# EAGLE design futurew (EAGLE 9.4.1)
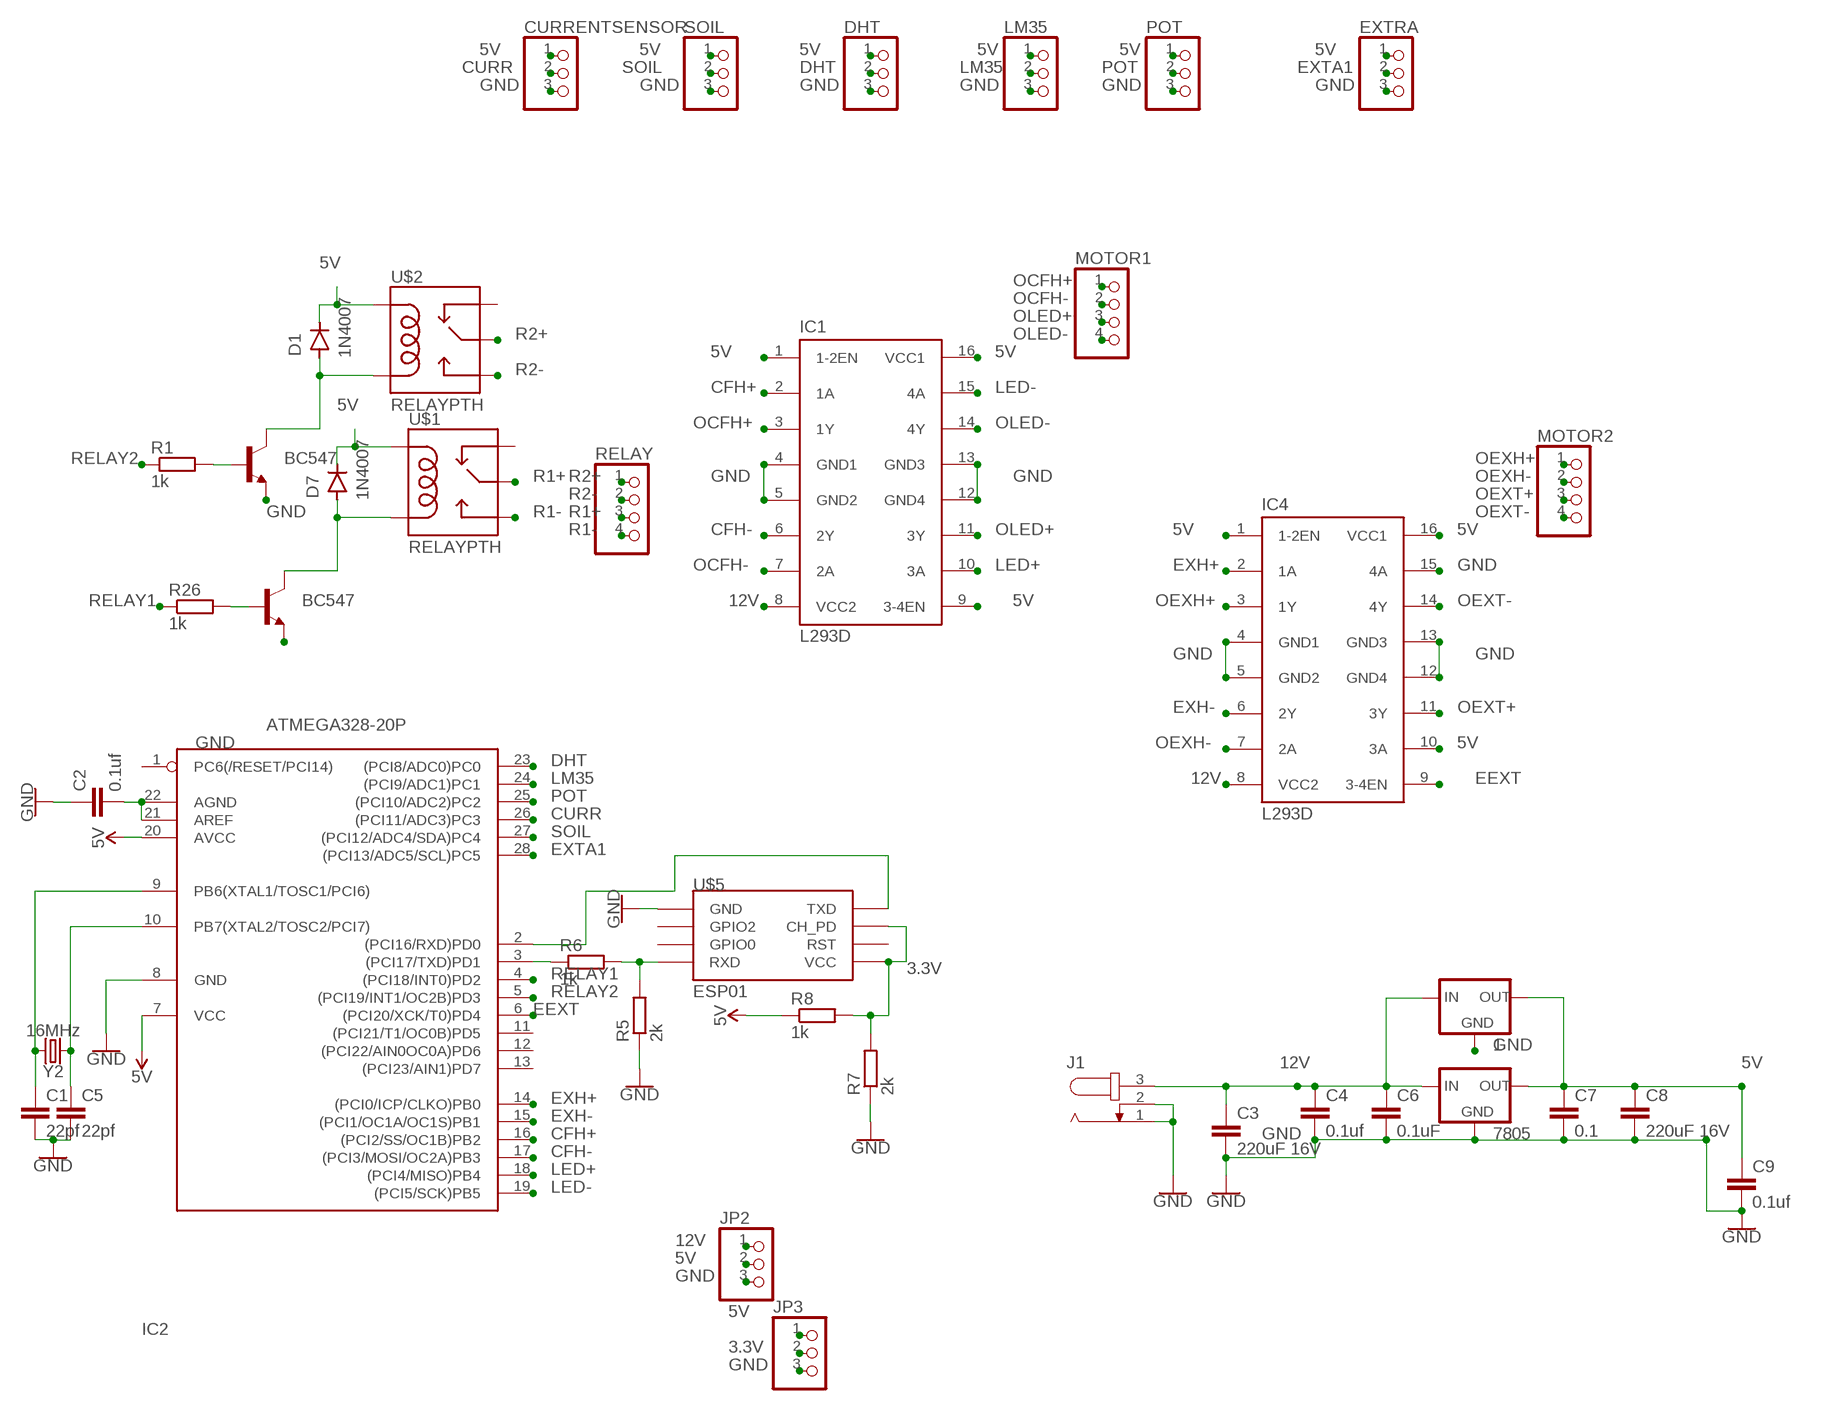
[diagram p0: schematic, sheet 1]

## Parts
1  78XXL  [78XXL]
7805  78XXL  [78XXL]
C1  22pf  C2,5-3  [C2.5-3]
C2  0.1uf  C2,5-3  [C2.5-3]
C3  220uF 16V  C2,5-3  [C2.5-3]
C4  0.1uf  C2,5-3  [C2.5-3]
C5  22pf  C2,5-3  [C2.5-3]
C6  0.1uF  C2,5-3  [C2.5-3]
C7  0.1  C2,5-3  [C2.5-3]
C8  220uF 16V  C2,5-3  [C2.5-3]
C9  0.1uf  C2,5-3  [C2.5-3]
CURRENTSENSOR  PINHD-1X3  [1X03]
D1  1N4007  [DO-41]
D7  1N4007  [DO-41]
DHT  PINHD-1X3  [1X03]
EXTRA  PINHD-1X3  [1X03]
IC1  L293D  [DIL16]
IC2  ATMEGA328-20P  [DIL28-3]
IC4  L293D  [DIL16]
J1  JACK-PLUG1  [SPC4078]
JP2  PINHD-1X3  [1X03]
JP3  PINHD-1X3  [1X03]
LM35  PINHD-1X3  [1X03]
MOTOR1  PINHD-1X4  [1X04]
MOTOR2  PINHD-1X4  [1X04]
POT  PINHD-1X3  [1X03]
R1  1k  R-EU_0204/5  [0204/5]
R5  2k  R-EU_0204/5  [0204/5]
R6  1k  R-EU_0204/5  [0204/5]
R7  2k  R-EU_0204/5  [0204/5]
R8  1k  R-EU_0204/5  [0204/5]
R26  1k  R-EU_0204/5  [0204/5]
RELAY  PINHD-1X4  [1X04]
SOIL  PINHD-1X3  [1X03]
T1  BC547  [TO92]
T3  BC547  [TO92]
U$1  RELAYPTH  [SRD-05VDC-SL-C]
U$2  RELAYPTH  [SRD-05VDC-SL-C]
U$5  ESP01  [ESP01]
Y2  16MHz  CRYSTAL-16MHZPTH-HC49US  [HC49US]

## Nets
3.3V: JP3.2 R7.2 R8.2 U$5.CH_PD U$5.VCC
5V: 1.OUT 7805.OUT C7.1 C8.1 C9.1 CURRENTSENSOR.1 D1.C D7.C DHT.1 EXTRA.1 IC1.1(1-2EN) IC1.9(3-4EN) IC1.16(VCC1) IC2.7(VCC) IC2.20(AVCC) IC4.1(1-2EN) IC4.10(3A) IC4.16(VCC1) JP2.2 JP3.1 LM35.1 POT.1 R8.1 SOIL.1 U$1.COIL1 U$2.COIL1
12V: 1.IN 7805.IN C3.1 C4.1 C6.1 IC1.8(VCC2) IC4.8(VCC2) J1.3 JP2.1
CFH+: IC1.2(1A) IC2.16((PCI2/SS/OC1B)PB2)
CFH-: IC1.6(2Y) IC2.17((PCI3/MOSI/OC2A)PB3)
CURR: CURRENTSENSOR.2 IC2.26((PCI11/ADC3)PC3)
DHT: DHT.2 IC2.23((PCI8/ADC0)PC0)
EEXT: IC2.6((PCI20/XCK/T0)PD4) IC4.9(3-4EN)
EXH+: IC2.14((PCI0/ICP/CLKO)PB0) IC4.2(1A)
EXH-: IC2.15((PCI1/OC1A/OC1S)PB1) IC4.6(2Y)
EXTA1: EXTRA.2 IC2.28((PCI13/ADC5/SCL)PC5)
GND: 1.GND 7805.GND C1.2 C2.1 C3.2 C4.2 C5.2 C6.2 C7.2 C8.2 C9.2 CURRENTSENSOR.3 DHT.3 EXTRA.3 IC1.4(GND1) IC1.5(GND2) IC1.12(GND4) IC1.13(GND3) IC2.8(GND) IC4.4(GND1) IC4.5(GND2) IC4.12(GND4) IC4.13(GND3) IC4.15(4A) J1.1 J1.2 JP2.3 JP3.3 LM35.3 POT.3 R5.1 R7.1 SOIL.3 T1.1(E) T3.1(E) U$5.GND
LED+: IC1.10(3A) IC2.18((PCI4/MISO)PB4)
LED-: IC1.15(4A) IC2.19((PCI5/SCK)PB5)
LM35: IC2.24((PCI9/ADC1)PC1) LM35.2
N$1: R5.2 R6.2 U$5.RX(RXD)
N$2: IC2.3((PCI17/TXD)PD1) R6.1
N$3: IC2.2((PCI16/RXD)PD0) U$5.TX(TXD)
N$4: D7.A T3.3(C) U$1.COIL0
N$5: R1.2 T1.2(B)
N$6: D1.A T1.3(C) U$2.COIL0
N$11: C2.2 IC2.21(AREF) IC2.22(AGND)
N$28: R26.2 T3.2(B)
N$43: C5.1 IC2.10(PB7(XTAL2/TOSC2/PCI7)) Y2.1
N$45: C1.1 IC2.9(PB6(XTAL1/TOSC1/PCI6)) Y2.2
OCFH+: IC1.3(1Y) MOTOR1.1
OCFH-: IC1.7(2A) MOTOR1.2
OEXH+: IC4.3(1Y) MOTOR2.1
OEXH-: IC4.7(2A) MOTOR2.2
OEXT+: IC4.11(3Y) MOTOR2.3
OEXT-: IC4.14(4Y) MOTOR2.4
OLED+: IC1.11(3Y) MOTOR1.3
OLED-: IC1.14(4Y) MOTOR1.4
POT: IC2.25((PCI10/ADC2)PC2) POT.2
R1+: RELAY.3 U$1.SWCOMMON
R1-: RELAY.4 U$1.SWOPEN
R2+: RELAY.1 U$2.SWCOMMON
R2-: RELAY.2 U$2.SWOPEN
RELAY1: IC2.4((PCI18/INT0)PD2) R26.1
RELAY2: IC2.5((PCI19/INT1/OC2B)PD3) R1.1
SOIL: IC2.27((PCI12/ADC4/SDA)PC4) SOIL.2
Unconnected: IC2.1(PC6(/RESET/PCI14)) IC2.11((PCI21/T1/OC0B)PD5) IC2.12((PCI22/AIN0OC0A)PD6) IC2.13((PCI23/AIN1)PD7) U$1.SWCLOSED(SWCLOSE) U$2.SWCLOSED(SWCLOSE) U$5.GPIO0 U$5.GPIO2 U$5.RST

## Library data of the parts
1 7805 = v-reg:78XXL: VOLTAGE REGULATOR
C1-C9 = capacitor-wima:C: CAPACITOR naming: grid - package width
CURRENTSENSOR DHT EXTRA JP2 JP3 LM35 POT SOIL = pinhead:PINHD-1X3: PIN HEADER
D1 D7 = Diodes:1N4007: DIODE GEN PURP 1KV 1A DO41; CREATED_BY: PCB Layout; DIGIKEY_PART_NUMBER: 1N4007MSCT-ND; MANUFACTURER: Micro Commercial Co; MPN: 1N4007; PACKAGE: DO-41
IC1 IC4 = st-microelectronics:L293D: PUSH-PULL 4 CHANNEL DRIVER; MPN: L293D; OC_FARNELL: 9589619; OC_NEWARK: 56P8249
IC2 = atmega328:ATMEGA328*P: MICROCONTROLLER 32 kBytes FLASH 2 kBytes SRAM 1 kBytes EEPROM USART 8-channel 10 bit ADC
J1 = con-jack:JACK-PLUG: DC POWER JACK Power Jack, DC, Right Angle, Through Hole, Rated 5A at 16VDC, PC Terminals Distributor: Farnell (www.Farnell.de) Drawing: 84N1161.pdf / 84N1162.pdf Manufacturer: SPC Technology (www.spctechnology.com) Type: SPC4077 / SPC 4078; OC_FARNELL: unknown; OC_NEWARK: unknown
MOTOR1 MOTOR2 RELAY = pinhead:PINHD-1X4: PIN HEADER
R1 R5-R8 R26 = resistor:R-EU_: RESISTOR, European symbol
T1 T3 = transistor:BC547: NPN TRANSISTOR
U$1 U$2 = SRD-05VDC-SL-C:RELAY: SPDT relay (COM-00101)
U$5 = esp8266modules:ESP01: ESP8266 Wifi module 01
Y2 = SparkFun-Clocks:CRYSTAL-16MHZ: 16MHz Crystal Digikey Example <http://www.digikey.com/product-search/en?keywords=535-9122-1-ND> Frequency: 16MHz Frequency Stability: ±50ppm Frequency Tolerance: ±20ppm Load Capacitance: 18pF SparkFun Products: Pro Micro -5V/16MHz <https://www.sparkfun.com/products/12640> SparkFun Serial Enabled LCD Kit <https://www.sparkfun.com/products/10097>; PROD_ID: XTAL-08181; SF_ID: COM-00536

## Net classes
0 default: width 1.016 mm, drill 0.051 mm, clearance 0.508 mm

## Board
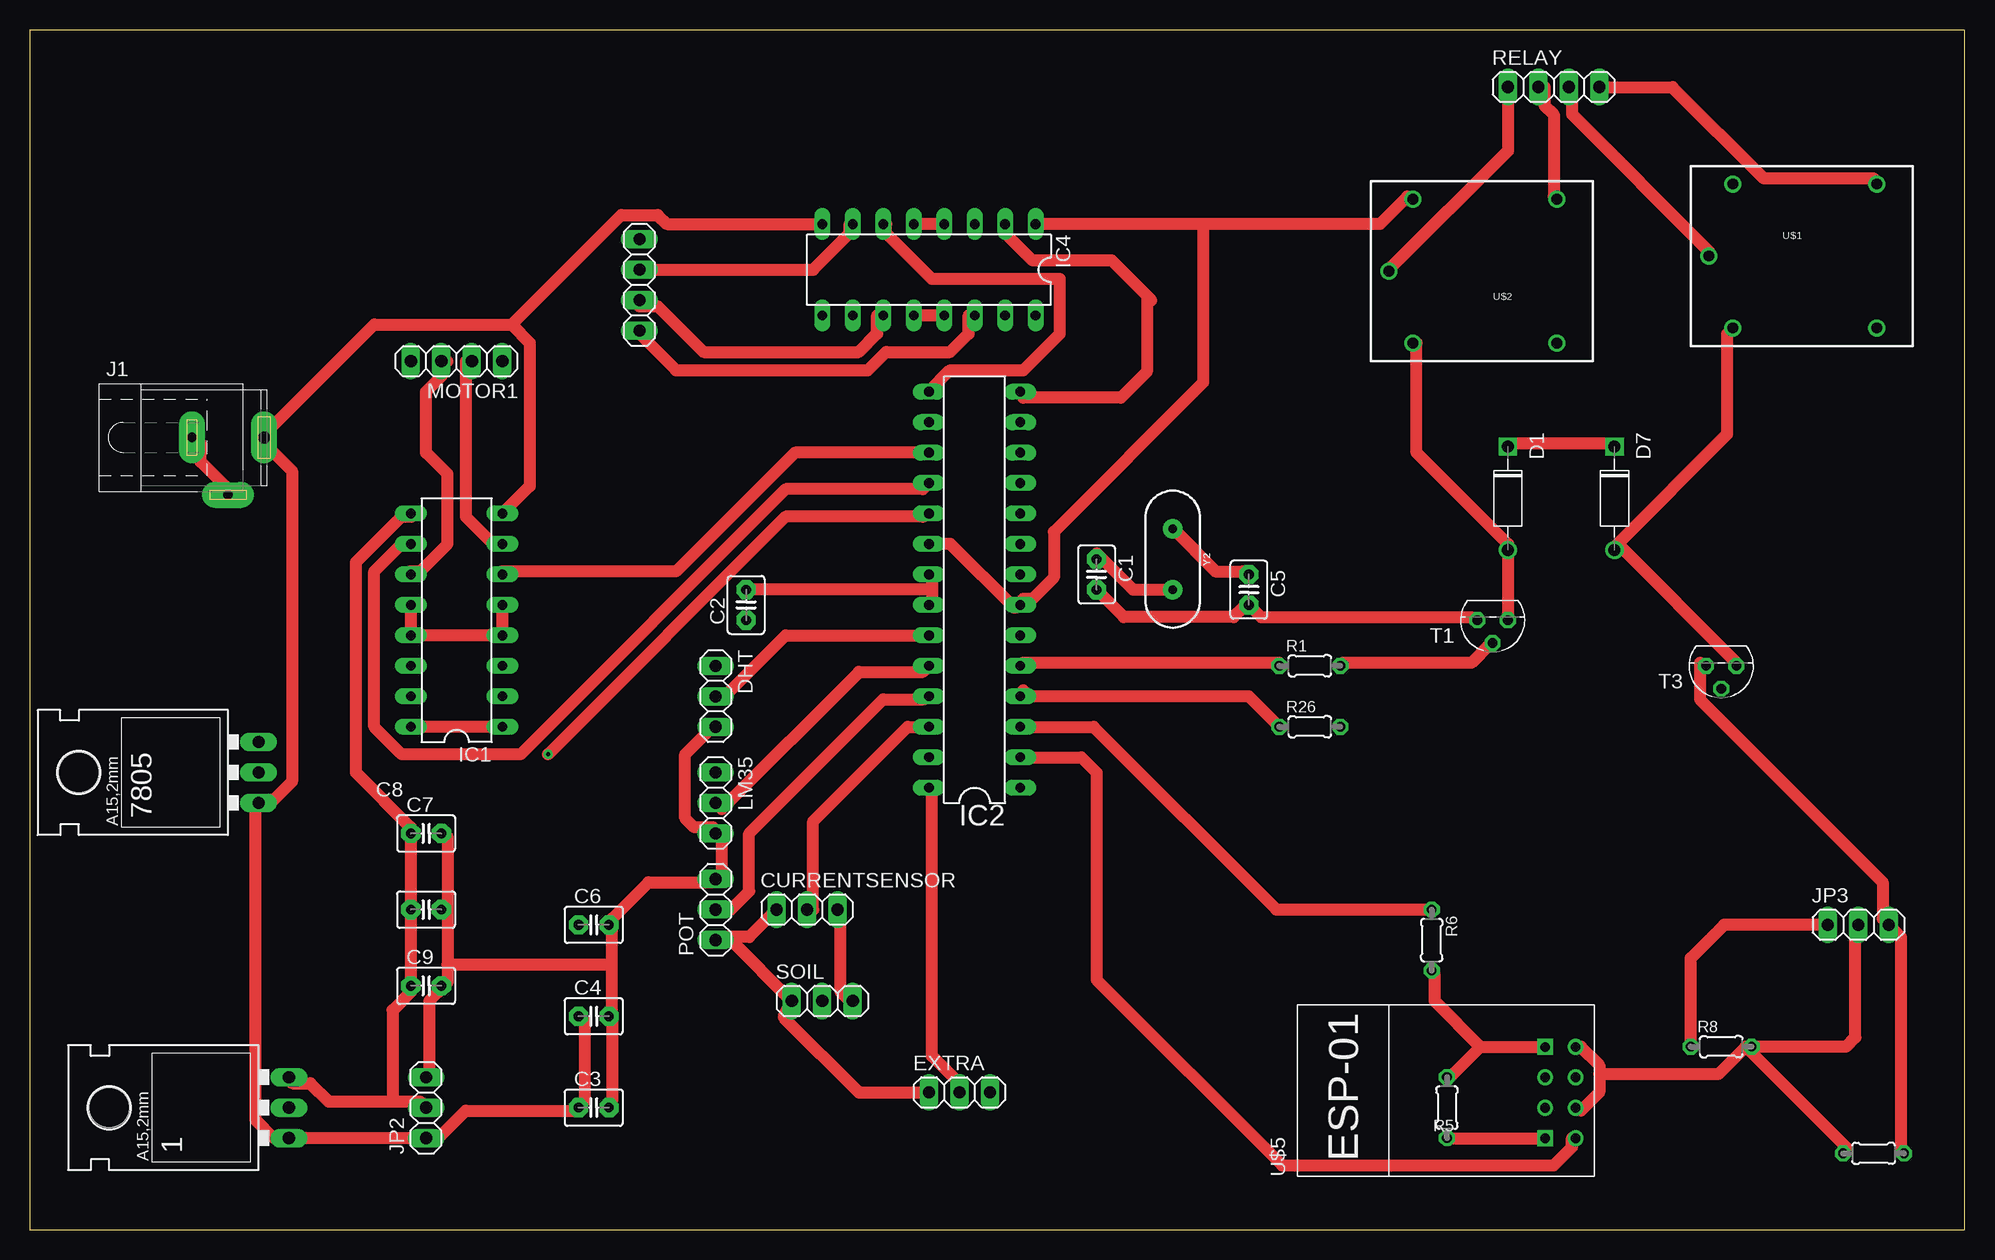
[diagram p1: board, top side]
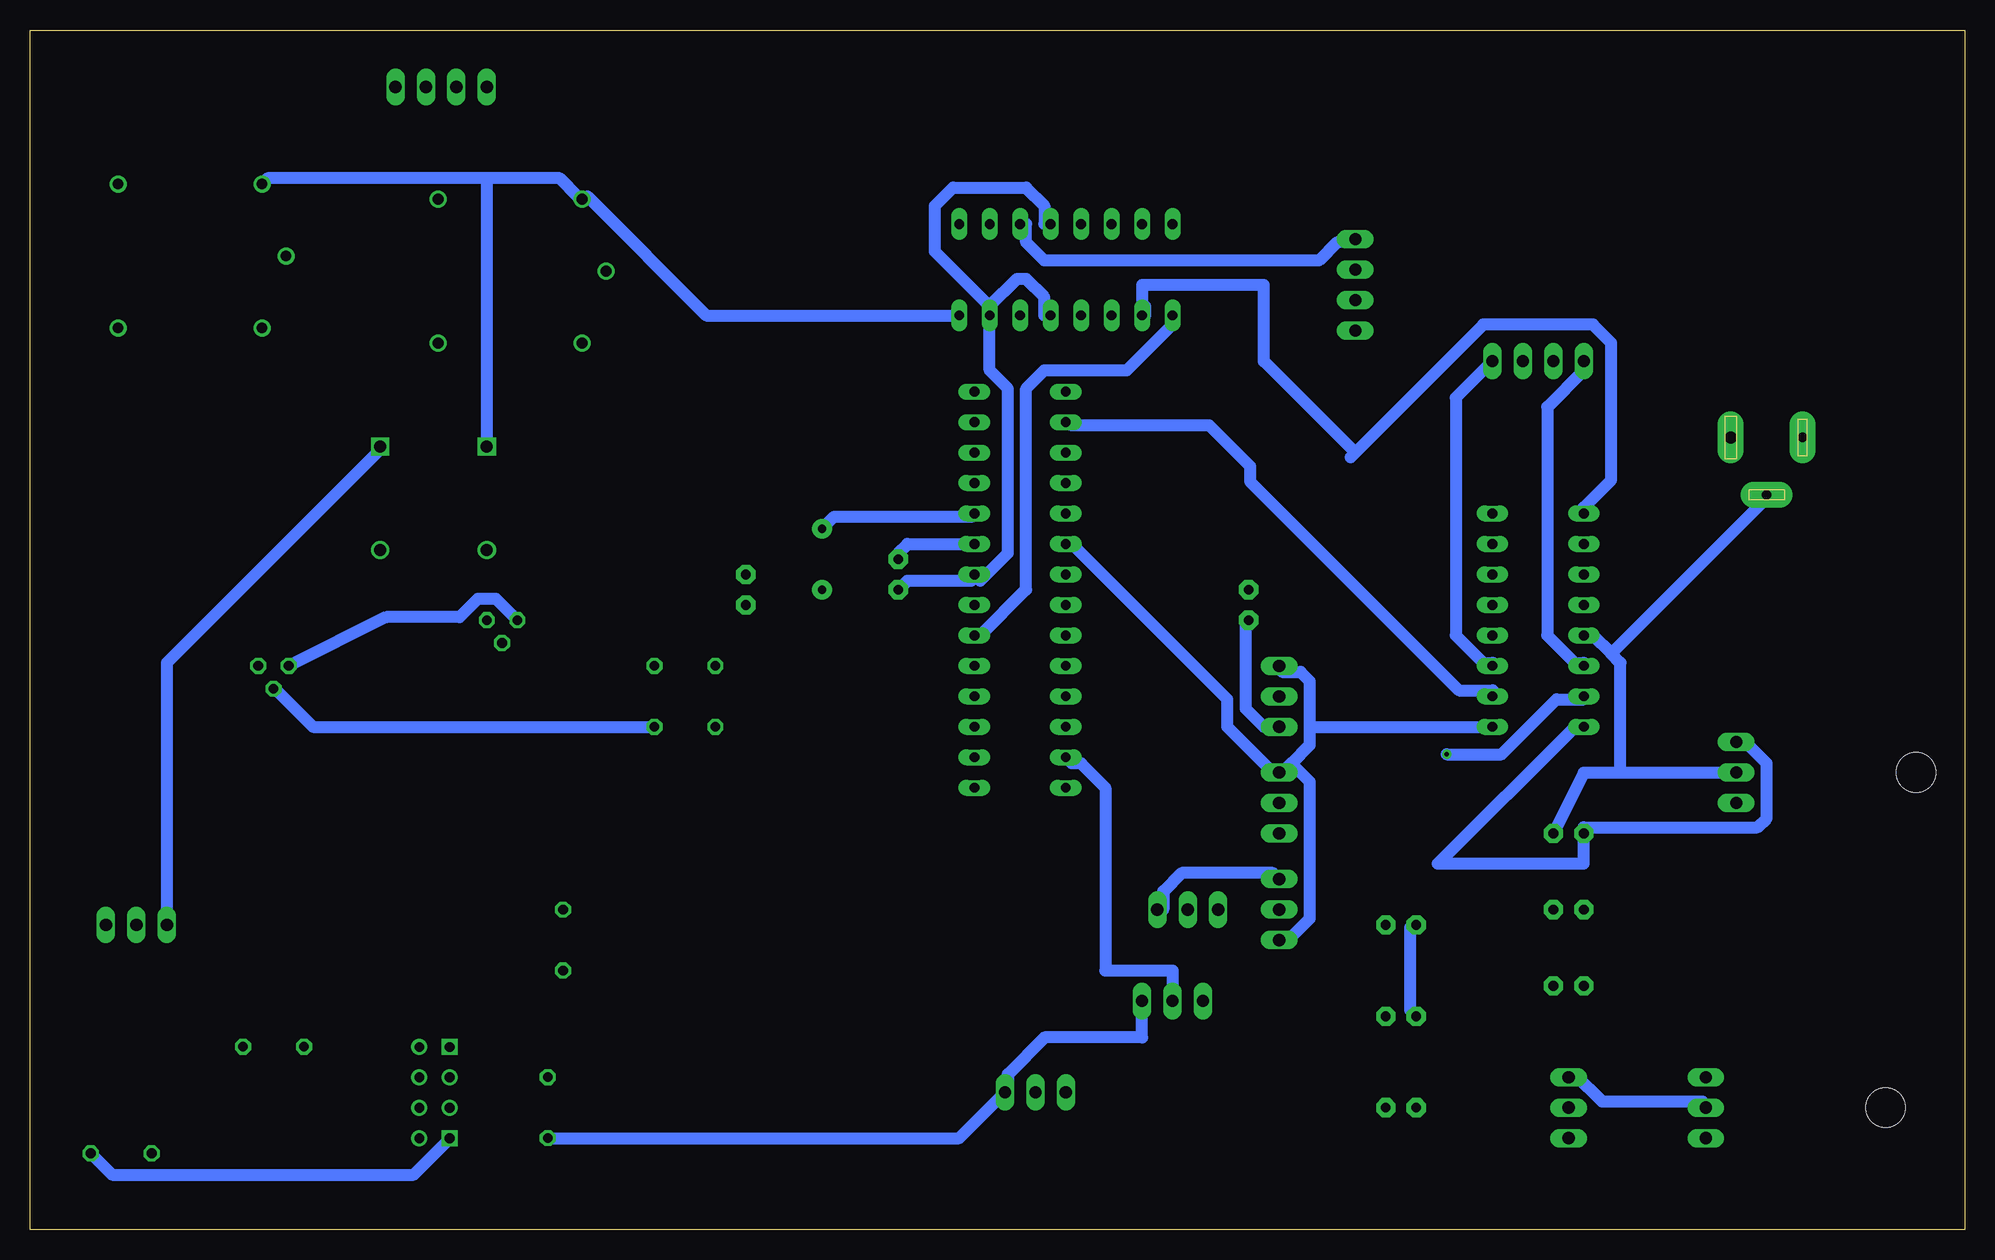
[diagram p2: board, bottom side, seen from below]

Size 161.27 x 100 mm. Coordinates in mm from the lower left corner, seen from the top.
Outline: 0,0 161.27,0 161.27,100 0,100 0,0
Copper layers (1*16): Top 0.035mm / dielectric 1.5mm / Bottom 0.035mm
Design rules "default": minimum track width 6mil, minimum drill 0.35mm, track to track 6mil, track to pad 6mil, pad to pad 6mil, via to via 6mil, smd to smd 6mil, copper to edge 40mil, drill to drill 6mil, minimum pad ring 10mil, minimum via ring 8mil, stop-mask expansion 4mil, vias tented up to drill 0mil, thermal gap 10mil

### Footprints (pad centres in the part's own frame; a part is rotated, then mirrored left to right if it is on the bottom)
78XXL = drill 1.016 long: GND 0,-3.81; IN -2.54,-3.81; OUT 2.54,-3.81 | hole 3.302: 0,11.176
C2.5-3 = drill 0.813 pad 1.6 octagon: 1 -1.27,0; 2 1.27,0
1X03 = drill 1.016 long: 1 -2.54,0; 2 0,0; 3 2.54,0
DO-41 = drill 1: A 4.325,0 | drill 1 square: C -4.325,0
DIL16 = drill 0.813 long: 1 -8.89,-3.81; 2 -6.35,-3.81; 3 -3.81,-3.81; 4 -1.27,-3.81; 5 1.27,-3.81; 6 3.81,-3.81; 7 6.35,-3.81; 8 8.89,-3.81; 9 8.89,3.81; 10 6.35,3.81; 11 3.81,3.81; 12 1.27,3.81; 13 -1.27,3.81; 14 -3.81,3.81; 15 -6.35,3.81; 16 -8.89,3.81
DIL28-3 = drill 0.813 long: 1 -16.51,-3.81; 2 -13.97,-3.81; 3 -11.43,-3.81; 4 -8.89,-3.81; 5 -6.35,-3.81; 6 -3.81,-3.81; 7 -1.27,-3.81; 8 1.27,-3.81; 9 3.81,-3.81; 10 6.35,-3.81; 11 8.89,-3.81; 12 11.43,-3.81; 13 13.97,-3.81; 14 16.51,-3.81; 15 16.51,3.81; 16 13.97,3.81; 17 11.43,3.81; 18 8.89,3.81; 19 6.35,3.81; 20 3.81,3.81; 21 1.27,3.81; 22 -1.27,3.81; 23 -3.81,3.81; 24 -6.35,3.81; 25 -8.89,3.81; 26 -11.43,3.81; 27 -13.97,3.81; 28 -16.51,3.81
SPC4078 = drill 0.8 pad 2.184 long: 1 -3,0; 2 0,-4.8 | drill 1 pad 2.184 long: 3 3,0
1X04 = drill 1.016 long: 1 -3.81,0; 2 -1.27,0; 3 1.27,0; 4 3.81,0
0204/5 = drill 0.813 octagon: 1 -2.54,0; 2 2.54,0
TO92 = drill 0.813 octagon: 1 1.27,0; 2 0,1.905; 3 -1.27,0
SRD-05VDC-SL-C = drill 0.9: COIL0 -5.39,-6.12; COIL1 -5.39,5.88; SWCLOSED 6.61,-6.12; SWCOMMON -7.39,-0.12; SWOPEN 6.61,5.88
ESP01 = drill 0.8: CH_PD -1.285,-8.178; GPIO0 1.255,-5.638; GPIO2 -1.285,-5.638; RST 1.255,-8.178; TX -3.825,-8.178; VCC 3.795,-8.178 | drill 0.8 square: GND -3.825,-5.638; RX 3.795,-5.638
HC49US = drill 0.7 pad 1.651: 1 -2.54,0; 2 2.54,0

### Placement (x,y rotation side)
1  17.78,10.16 90 top
7805  15.24,38.1 90 top
C1  [C2.5-3]  88.9,54.61 270 top
C2  [C2.5-3]  59.69,52.07 90 top
C3  46.99,10.16 0 top
C4  [C2.5-3]  46.99,17.78 0 top
C5  [C2.5-3]  101.6,53.34 270 top
C6  46.99,25.4 0 top
C7  33.02,33.02 0 top
C8  33.02,26.67 0 top
C9  [C2.5-3]  33.02,20.32 0 top
CURRENTSENSOR  64.77,26.67 0 top
D1  123.19,60.96 270 top
D7  132.08,60.96 270 top
DHT  57.15,44.45 270 top
EXTRA  77.47,11.43 0 top
IC1  35.56,50.8 90 top
IC2  78.74,53.34 90 top
IC4  74.93,80.01 180 top
J1  16.51,66.04 0 top
JP2  33.02,10.16 90 top
JP3  152.4,25.4 0 top
LM35  57.15,35.56 270 top
MOTOR1  35.56,72.39 180 top
MOTOR2  50.8,78.74 270 top
POT  57.15,26.67 90 top
R1  106.68,46.99 0 top
R5  [0204/5]  118.11,10.16 90 top
R6  [0204/5]  116.84,24.13 270 top
R7  [0204/5]  153.67,6.35 180 top
R8  [0204/5]  140.97,15.24 0 top
R26  106.68,41.91 0 top
RELAY  127,95.25 0 top
SOIL  66.04,19.05 0 top
T1  121.92,50.8 180 top
T3  140.97,46.99 180 top
U$1  147.32,81.28 0 top
U$2  120.65,80.01 0 top
U$5  120.65,11.43 90 top
Y2  95.25,55.88 270 top

### Tracks (layer width: path | path; a pad name or v marks a point on that pad's centre or on a via)
3.3V
  Top 1.016: 130.81,12.95 130.81,13.72 129.29,15.24 U$5.VCC | 130.81,12.95 130.81,11.43 129.29,9.91 U$5.CH_PD | 143,15.24 151.38,6.86 R7.2 | JP3.2 152.15,25.15 152.15,16 151.38,15.24 R8.2 143,15.24 | 130.81,12.95 140.72,12.95 143,15.24
5V
  Top 1.016: CURRENTSENSOR.1 59.94,24.38 57.66,24.38 POT.1 58.42,24.13 SOIL.1 62.82,17.7 69.09,11.43 EXTRA.1 | IC2.20 76.71,57.15 82.04,51.82 IC2.7 82.8,52.58 83.57,52.58 85.34,54.36 85.34,58.17 97.79,70.61 97.79,83.82 | IC1.1 IC1.16 | 30.23,10.67 24.89,10.67 23.37,12.19 21.84,12.19 1.OUT | 30.23,10.67 32.51,10.67 JP2.2 | IC1.9 31.75,59.44 30.99,59.44 27.18,55.63 27.18,38.1 31.75,33.53 C7.1 C8.1 C9.1 31.75,19.81 30.23,18.29 30.23,10.67 | JP3.1 141.22,25.4 138.43,22.61 R8.1 | D1.C 123.19,65.53 131.57,65.53 D7.C | 97.79,83.82 112.52,83.82 114.81,86.11 U$2.COIL1 | 97.79,83.82 IC4.1
  Bottom 1.016: 56.13,38.86 54.61,40.39 54.61,41.91 | 56.13,38.86 56.9,38.1 LM35.1 57.66,38.1 61.47,41.91 61.47,44.2 74.42,57.15 IC2.20 | 54.61,41.91 54.61,45.72 55.37,46.48 56.9,46.48 DHT.1 | 54.61,41.91 IC1.1 | 56.13,38.86 54.61,37.34 54.61,25.91 56.13,24.38 56.9,24.38 POT.1 | 68.33,76.96 68.33,76.2 | 50.8,64.77 40.13,75.44 30.99,75.44 29.46,73.91 29.46,62.48 31.75,60.2 IC1.9 | 50.8,64.77 51.18,64.39 | 68.33,76.2 IC4.10 | 7805.OUT 18.8,40.39 18.03,40.39 16.51,38.86 16.51,34.29 17.27,33.53 31.75,33.53 C7.1 31.75,30.48 43.94,30.48 32.51,41.91 IC1.16 | IC4.16 104.9,76.2 114.81,86.11 U$2.COIL1 115.57,86.11 117.09,87.63 123.19,87.63 | 123.19,87.63 141.48,87.63 U$1.COIL1 | 123.19,87.63 D1.C | JP3.1 149.86,47.24 132.33,64.77 D7.C | 50.8,64.77 58.42,72.39 58.42,78.74 68.58,78.74 68.58,76.45 68.33,76.2
12V
  Top 1.016: C4.1 46.23,17.53 46.23,10.67 C3.1 45.47,9.91 36.32,9.91 34.04,7.62 JP2.1 1.IN 20.32,7.62 18.8,9.14 18.8,35.05 7805.IN 19.56,35.81 20.32,35.81 21.84,37.34 21.84,63.25 19.56,65.53 J1.3 19.56,66.29 28.7,75.44 40.13,75.44 | IC1.8 41.66,61.98 41.66,73.91 40.13,75.44 | IC4.8 53.09,83.82 52.32,84.58 49.28,84.58 40.13,75.44
  Bottom 1.016: C6.1 46.23,25.15 46.23,18.29 C4.1
CFH+
  Bottom 1.016: IC1.2 39.37,44.96 42.16,44.96 59.56,62.36 59.56,63.63 62.99,67.06 74.42,67.06 IC2.16
CFH-
  Top 1.016: IC2.17 63.75,64.77 53.85,54.86 39.37,54.86 IC1.6
CURR
  Top 1.016: IC2.26 73.15,41.91 65.28,34.04 65.28,26.67 CURRENTSENSOR.2
DHT
  Top 1.016: IC2.23 62.99,49.53 57.66,44.2 DHT.2
EEXT
  Bottom 1.016: IC4.9 66.04,75.44 69.85,71.63 76.71,71.63 78.23,70.1 78.23,53.34 82.04,49.53 IC2.6
EXH+
  Top 1.016: IC4.2 81.28,83.06 83.57,80.77 90.17,80.77 93.09,77.85 | 93.47,77.47 93.09,77.85 | IC2.14 82.8,69.34 90.93,69.34 93.09,71.5 93.09,77.85
EXH-
  Top 1.016: IC2.15 76.71,71.63 82.8,71.63 85.85,74.68 85.85,79.25 75.18,79.25 71.37,83.06 71.37,83.82 IC4.6
EXTA1
  Top 1.016: EXTRA.2 77.47,12.19 75.18,14.48 75.18,36.58 IC2.28
GND
  Top 1.016: SOIL.3 68.33,19.05 67.56,19.81 67.56,26.67 CURRENTSENSOR.3 | C3.2 48.51,10.67 48.51,17.53 C4.2 48.51,18.29 48.51,22.1 | 48.51,22.1 48.51,25.15 C6.2 48.51,25.91 51.56,28.96 56.9,28.96 POT.3 57.66,29.72 57.66,32.77 LM35.3 56.9,33.53 55.37,33.53 54.61,34.29 54.61,39.62 56.9,41.91 DHT.3 | J1.1 14.22,65.53 14.22,64.01 16.51,61.72 J1.2 | IC1.12 IC1.13 IC1.4 IC1.5 | 34.8,26.67 34.8,22.1 | 34.8,22.1 34.8,20.57 C9.2 34.04,19.81 33.27,19.05 33.27,12.95 JP2.3 | 34.8,26.67 34.8,32.77 C7.2 | 34.8,26.67 C8.2 | 34.8,22.1 48.51,22.1 | R5.1 126.24,7.62 U$5.GND | R7.1 155.96,6.86 155.96,24.38 JP3.3 154.43,25.91 154.43,28.96 139.19,44.2 139.19,47.24 T3.1 | IC4.4 IC4.5 | IC4.13 IC4.12 | T1.1 120.14,51.05 102.62,51.05 C5.2 101.09,51.82 100.33,51.05 91.19,51.05 C1.2
  Bottom 1.016: SOIL.3 68.58,16 76.71,16 79.76,12.95 79.76,11.43 EXTRA.3 83.82,7.62 R5.1 | DHT.3 58.42,41.91 59.94,43.43 59.94,50.29 C2.1 | CURRENTSENSOR.3 66.8,26.67 66.8,28.19 65.28,29.72 57.66,29.72 POT.3 | 1.GND 21.84,10.67 30.23,10.67 32.51,12.95 JP2.3 | 28.7,38.1 31.75,38.1 C7.2 | 28.7,38.1 7805.GND | IC1.13 30.99,49.53 29.46,48.01 | 29.46,48.01 28.7,47.24 28.7,38.1 | 29.46,48.01 16.51,60.96 J1.2 | R7.1 154.43,4.57 129.29,4.57 126.24,7.62 U$5.GND | 81.28,76.96 78.99,79.25 78.23,79.25 76.71,77.72 76.71,76.2 IC4.13 | 81.28,76.96 85.85,81.53 85.85,85.34 84.33,86.87 78.23,86.87 76.71,85.34 76.71,83.82 IC4.4 | 81.28,76.96 IC4.15 81.28,71.63 79.76,70.1 79.76,56.39 82.04,54.1 IC2.8 82.8,54.1 88.14,54.1 C1.2 | T1.1 122.43,52.58 123.95,52.58 125.48,51.05 131.57,51.05 T3.1
LED+
  Top 1.016: IC1.10 30.99,57.15 28.7,54.86 28.7,41.91 30.99,39.62 40.89,39.62 62.99,61.72 74.42,61.72 IC2.18
LED-  (via drill 0.35)
  Top 1.016: v43.18,39.62 62.99,59.44 74.42,59.44 IC2.19
  Bottom 1.016: v43.18,39.62 38.61,39.62 34.04,44.2 31.75,44.2 IC1.15
LM35
  Top 1.016: IC2.24 74.42,46.48 69.09,46.48 57.66,35.05 LM35.2
N$1
  Top 1.016: 120.9,15.24 126.24,15.24 U$5.RX | 120.9,15.24 118.62,12.95 R5.2 | 120.9,15.24 117.09,19.05 117.09,21.34 R6.2
N$2
  Top 1.016: R6.1 103.89,26.67 88.65,41.91 IC2.3
N$3
  Top 1.016: U$5.TX 128.52,7.62 128.52,6.86 127,5.33 104.39,5.33 88.9,20.83 88.9,38.1 87.63,39.37 IC2.2
N$4
  Top 1.016: 132.33,57.15 142.24,47.24 T3.3 | 132.33,57.15 141.48,66.29 141.48,74.68 U$1.COIL0 | 132.33,57.15 D7.A
N$5
  Top 1.016: R1.2 109.47,47.24 120.14,47.24 121.67,48.77 T1.2
N$6
  Top 1.016: T1.3 D1.A 123.19,57.15 115.57,64.77 115.57,73.91 U$2.COIL0
N$11
  Top 1.016: 75.18,53.34 75.18,54.1 IC2.21 | 75.18,53.34 75.18,52.58 IC2.22 | 75.18,53.34 C2.2
N$28
  Bottom 1.016: R26.2 137.67,41.91 140.72,44.96 T3.2
N$43
  Top 1.016: Y2.1 98.81,54.86 101.09,54.86 C5.1
  Bottom 1.016: Y2.1 94.23,59.44 82.8,59.44 IC2.10
N$45
  Top 1.016: Y2.2 91.95,53.34 88.9,56.39 C1.1
  Bottom 1.016: IC2.9 88.14,57.15 88.9,56.39 C1.1
OCFH+
  Bottom 1.016: MOTOR1.1 42.42,69.34 42.42,49.53 40.13,47.24 39.37,47.24 IC1.3
OCFH-
  Top 1.016: IC1.7 38.61,57.15 36.32,59.44 36.32,72.39 MOTOR1.2
OEXH+
  Bottom 1.016: IC4.3 78.23,83.82 78.23,82.3 76.71,80.77 53.85,80.77 52.32,82.3 50.8,82.3 MOTOR2.1
OEXH-
  Top 1.016: MOTOR2.2 65.28,80.01 68.33,83.06 68.33,83.82 IC4.7
OEXT+
  Top 1.016: IC4.11 70.61,76.2 70.61,74.68 69.09,73.15 56.13,73.15 52.32,76.96 50.8,76.96 MOTOR2.3
OEXT-
  Top 1.016: IC4.14 78.23,76.2 78.23,74.68 76.71,73.15 71.37,73.15 69.85,71.63 53.85,71.63 50.8,74.68 MOTOR2.4
OLED+
  Top 1.016: IC1.11 31.75,54.86 32.51,54.86 34.8,57.15 34.8,62.99 33.02,64.77 33.02,69.85 34.29,71.12 MOTOR1.3 34.8,72.39
OLED-
  Bottom 1.016: MOTOR1.4 31.75,71.63 34.8,68.58 34.8,49.53 32.51,47.24 31.75,47.24 IC1.14
POT
  Top 1.016: POT.2 58.42,26.67 59.94,28.19 59.94,33.02 71.12,44.2 74.42,44.2 IC2.25
R1+
  Top 1.016: U$1.SWCOMMON 139.95,81.53 128.52,92.96 128.52,95.25 RELAY.3
R1-
  Top 1.016: RELAY.4 136.91,95.25 144.53,87.63 153.67,87.63 U$1.SWOPEN
R2+
  Top 1.016: RELAY.1 123.19,89.92 113.28,80.01 U$2.SWCOMMON
R2-
  Top 1.016: U$2.SWOPEN 127,86.11 127,92.96 126.24,93.73 126.24,95.25 RELAY.2
RELAY1
  Top 1.016: R26.1 101.6,44.45 83.31,44.45 82.8,44.96 IC2.4
RELAY2
  Top 1.016: IC2.5 82.8,47.24 104.14,47.24 R1.1
SOIL
  Bottom 1.016: IC2.27 74.42,38.86 73.66,38.86 71.63,36.83 71.63,21.59 66.04,21.59 SOIL.2